# Altium schematic sheet Power_Sheet.SchDoc
size A
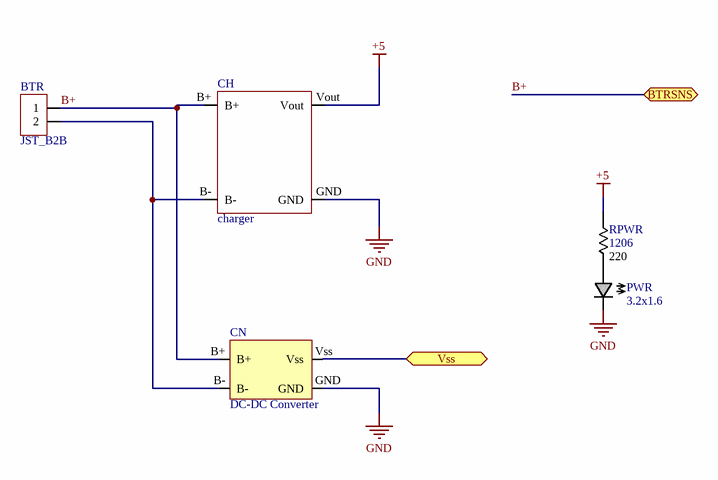
[diagram p0: Power_Sheet.SchDoc]

## Parts
BTR  JST_B2B  [JST_B2B]
CH  charger  [1S_Charger]
CN  DC-DC Converter  [DC-DC Conv]
PWR  3.2x1.6  [LED3_2X1_6]
RPWR  1206  value 220  [1206]

## Ports
BTRSNS (bidir), Vss (bidir)

## Nets
+5: CH.Vout RPWR.2
GND: CH.GND CN.GND PWR.C
B+: BTR.1 CH.B+ CN.B+ ; port BTRSNS
Vss: CN.Vss ; port Vss
NetBTR_2: BTR.2 CH.B- CN.B-
NetPWR_A: PWR.A RPWR.1

## Library data of the parts
CN = DC-DC Converter: pin to pad: GND>Vout- Vss>Vout+
PWR = led